# Altium schematic sheet Schematic.SchDoc
size A4
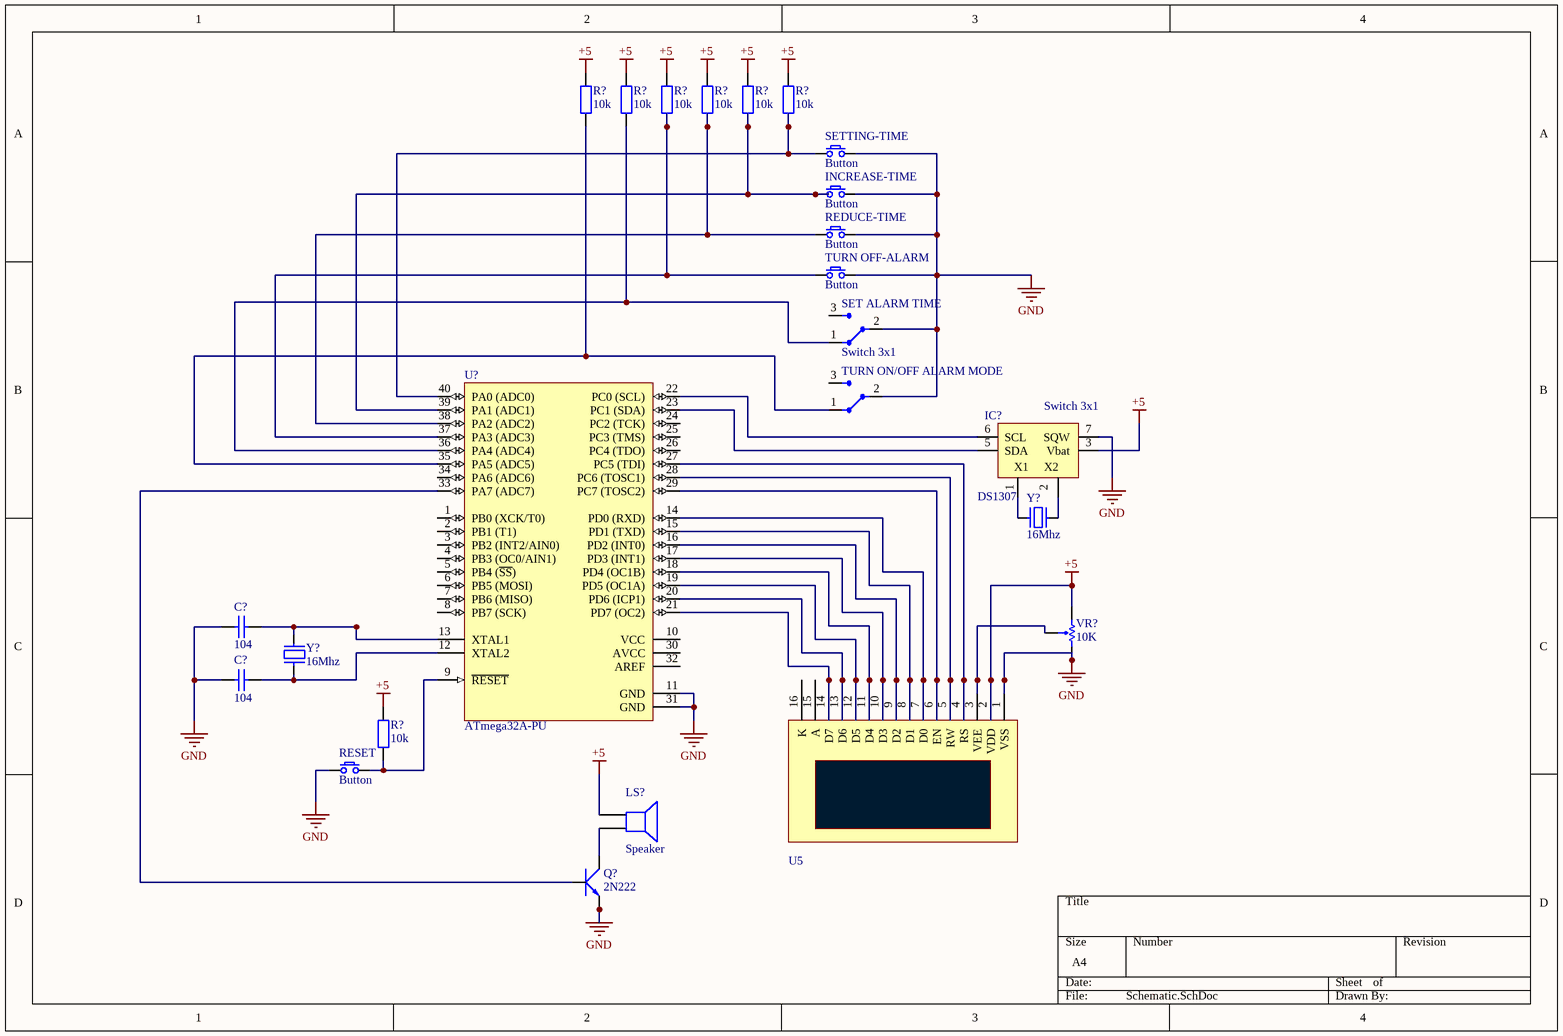
[diagram p0: Schematic.SchDoc]

## Parts
(Parts that share a designator on the sheet are numbered #1, #2 ... from top to bottom, then left to right.)
C?#1  104  [tu 1206]
C?#2  104  [tu 1206]
IC?  DS1307  [DIP8]
INCREASE-TIME  Button  [SW/2/DIP]
LS?  Speaker  [PIN2]
Q?  2N222  [TO92-123]
R?#1  10k  [tro vach 1/4w]
R?#2  10k  [tro vach 1/4w]
R?#3  10k  [tro vach 1/4w]
R?#4  10k  [tro vach 1/4w]
R?#5  10k  [tro vach 1/4w]
R?#6  10k  [tro vach 1/4w]
R?#7  10k  [tro vach 1/4w]
REDUCE-TIME  Button  [SW/2/DIP]
RESET  Button  [SW/2/DIP]
SET_ALARM_TIME  Switch 3x1  [SW3x1]
SETTING-TIME  Button  [SW/2/DIP]
TURN_OFF-ALARM  Button  [SW/2/DIP]
TURN_ON/OFF_ALARM_MODE  Switch 3x1  [SW3x1]
U5  LCD  [LCD16X2]  (value not drawn)
U?  ATmega32A-PU  [DIP40/W0.6]
VR?  10K  [R VAR A 3D]
Y?#1  16Mhz  [Thach Anh 2 chan SMD]
Y?#2  16Mhz  [Thach Anh 2 chan SMD]

## Nets
+5: IC?.3(Vbat) LS?.1 R?#1.2 R?#2.2 R?#3.2 R?#4.2 R?#5.2 R?#6.2 R?#7.2 U5.2(VDD) VR?.3
GND: C?#1.2 C?#2.2 IC?.4(GND) IC?.7(SQW) INCREASE-TIME.2 Q?.1(E) REDUCE-TIME.2 RESET.1 SET_ALARM_TIME.2 SETTING-TIME.2 TURN_OFF-ALARM.2 TURN_ON/OFF_ALARM_MODE.2 U5.1(VSS) U?.11(GND) U?.31(GND) VR?.1
VCC: IC?.8(VCC)
NetC?#1_1: C?#1.1 U?.13(XTAL1) Y?#2.2
NetC?#2_1: C?#2.1 U?.12(XTAL2) Y?#2.1
NetIC?_1: IC?.1(X1) Y?#1.2
NetIC?_2: IC?.2(X2) Y?#1.1
NetIC?_5: IC?.5(SDA) U?.23(PC1_(SDA))
NetIC?_6: IC?.6(SCL) U?.22(PC0_(SCL))
NetINCREASE-TIME_1: INCREASE-TIME.1 R?#5.1 U?.39(PA1_(ADC1))
NetLS?_2: LS?.2 Q?.3(C)
NetQ?_2: Q?.2(B) U?.33(PA7_(ADC7))
NetR?#1_1: R?#1.1 TURN_ON/OFF_ALARM_MODE.1 U?.35(PA5_(ADC5))
NetR?#2_1: R?#2.1 SET_ALARM_TIME.1 U?.36(PA4_(ADC4))
NetR?#3_1: R?#3.1 TURN_OFF-ALARM.1 U?.37(PA3_(ADC3))
NetR?#4_1: R?#4.1 REDUCE-TIME.1 U?.38(PA2_(ADC2))
NetR?#6_1: R?#6.1 SETTING-TIME.1 U?.40(PA0_(ADC0))
NetR?#7_1: R?#7.1 RESET.2 U?.9(~{RESET})
NetU5_3: U5.3(VEE) VR?.2
NetU5_4: U5.4(RS) U?.27(PC5_(TDI))
NetU5_5: U5.5(RW) U?.28(PC6_(TOSC1))
NetU5_6: U5.6(EN) U?.29(PC7_(TOSC2))
NetU5_7: U5.7(D0) U?.14(PD0_(RXD))
NetU5_8: U5.8(D1) U?.15(PD1_(TXD))
NetU5_9: U5.9(D2) U?.16(PD2_(INT0))
NetU5_10: U5.10(D3) U?.17(PD3_(INT1))
NetU5_11: U5.11(D4) U?.18(PD4_(OC1B))
NetU5_12: U5.12(D5) U?.19(PD5_(OC1A))
NetU5_13: U5.13(D6) U?.20(PD6_(ICP1))
NetU5_14: U5.14(D7) U?.21(PD7_(OC2))

Not connected (* = marked no-connect by the designer): SET_ALARM_TIME 3(I/O2); TURN_ON/OFF_ALARM_MODE 3(I/O2); U5 15(A) 16(K); U? 1(PB0_(XCK/T0)) 2(PB1_(T1)) 3(PB2_(INT2/AIN0)) 4(PB3_(OC0/AIN1)) 5(PB4_(~{SS})) 6(PB5_(MOSI)) 7(PB6_(MISO)) 8(PB7_(SCK)) 10(VCC) 24(PC2_(TCK)) 25(PC3_(TMS)) 26(PC4_(TDO)) 30(AVCC) 32(AREF) 34(PA6_(ADC6))

## Library data of the parts
C?#1 C?#2 = Tu 1206 104 50V 20%: Dán; Don_Vi: Con; So_Chan: 2; Ten_Linh_Kien: Tụ 1206 104-0.1uF 20% 50V; Ma_Hang: MH004544; Chung_Loai: Dán; Kieu_Chan: *
IC? = DS1307: Real Timer Serial; Value: DS1307
INCREASE-TIME REDUCE-TIME RESET SETTING-TIME TURN_OFF-ALARM = SW SPST: Tact switch 2 pin
LS? = Speaker: Loudspeaker; Published: 24-Mar-1999; LatestRevisionDate: 17-Jul-2002; LatestRevisionNote: Re-released for DXP Platform.; PackageReference: PIN2; Publisher: Altium Limited
Q? = 2N222: NPN 600mW, ECB; Value: C1815
R?#1-R?#7 = Tro Vach 1/4W 5% 10k: Căm; Chung_Loai: Cắm; Don_Vi: Con; So_Chan: 2; Ten_Linh_Kien: Trở Vạch 1/4w 5% 10K; Ma_Hang: MH007354; Kieu_Chan: *
SET_ALARM_TIME TURN_ON/OFF_ALARM_MODE = SW3x1: Value: Switch 4x2
U5 = LCD: Value: LCD16x2
U? = ATmega32A-PU: 8-Bit AVR Microcontroller with 32K Bytes of In-System Programmable Flash Memory; Published: 17-Sep-2003; DatasheetVersion: 2503C-AVR-10/02; PackageVersion: revB, Sep-2001; PackageReference: 40P6; Publisher: Altium Limited; PackageDescription: 40-lead (0.600"/15.24mm Wide) Plastic Dual Inline Package (PDIP); Supplier 1: Digi-Key; Supplier Part Number 1: ATMEGA32-16PC-ND; Supplier 2: Mouser; Supplier Part Number 2: 556-ATMEGA32-16PC; Code_JEDEC: MS-011-AC; ComponentLink1Description: Datasheet; ComponentLink1URL: http://www.atmel.com/dyn/resources/prod_documents/doc2503.pdf; ComponentLink2Description: Atmel.com Home; ComponentLink2URL: http://www.atmel.com
VR? = Resistor Variable
Y?#1 Y?#2 = Thach Anh 2 chan SMD: Crystal For all Crystal 2pin.; Value: 4Mhz